# Altium schematic sheet PCB_Spartan.SchDoc
size A4
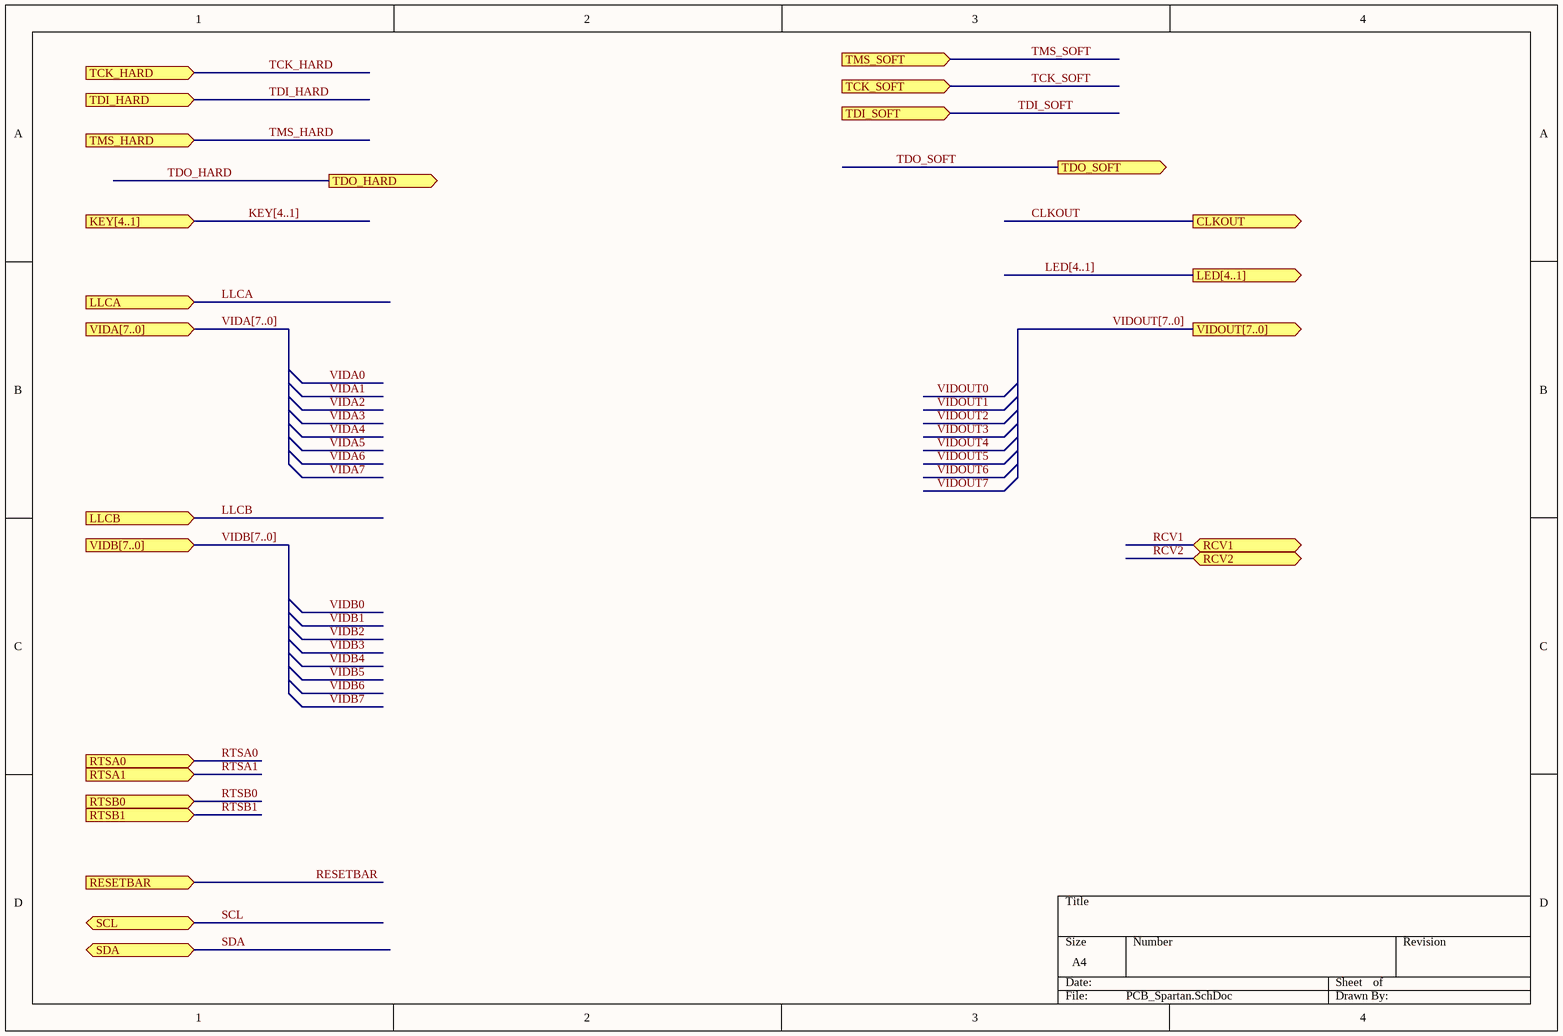
[diagram p0: PCB_Spartan.SchDoc]

## Ports
CLKOUT (out), KEY[4..1] (in), LED[4..1] (out), LLCA (in), LLCB (in), RCV1 (bidir), RCV2 (bidir), RESETBAR (in), RTSA0 (in), RTSA1 (in), RTSB0 (in), RTSB1 (in), SCL (bidir), SDA (bidir), TCK_HARD (in), TCK_SOFT (in), TDI_HARD (in), TDI_SOFT (in), TDO_HARD (out), TDO_SOFT (out), TMS_HARD (in), TMS_SOFT (in), VIDA[7..0] (in), VIDB[7..0] (in), VIDOUT[7..0] (out)

## Nets
CLKOUT: port CLKOUT
LLCA: port LLCA
LLCB: port LLCB
RCV1: port RCV1
RCV2: port RCV2
RESETBAR: port RESETBAR
RTSA0: port RTSA0
RTSA1: port RTSA1
RTSB0: port RTSB0
RTSB1: port RTSB1
SCL: port SCL
SDA: port SDA
TCK_HARD: port TCK_HARD
TCK_SOFT: port TCK_SOFT
TDI_HARD: port TDI_HARD
TDI_SOFT: port TDI_SOFT
TDO_HARD: port TDO_HARD
TDO_SOFT: port TDO_SOFT
TMS_HARD: port TMS_HARD
TMS_SOFT: port TMS_SOFT

## Buses and harness runs
bus KEY[4..1] = port KEY[4..1]
bus LED[4..1] = port LED[4..1]
bus VIDA[7..0] = port VIDA[7..0]
bus VIDB[7..0] = port VIDB[7..0]
bus VIDOUT[7..0] = port VIDOUT[7..0]